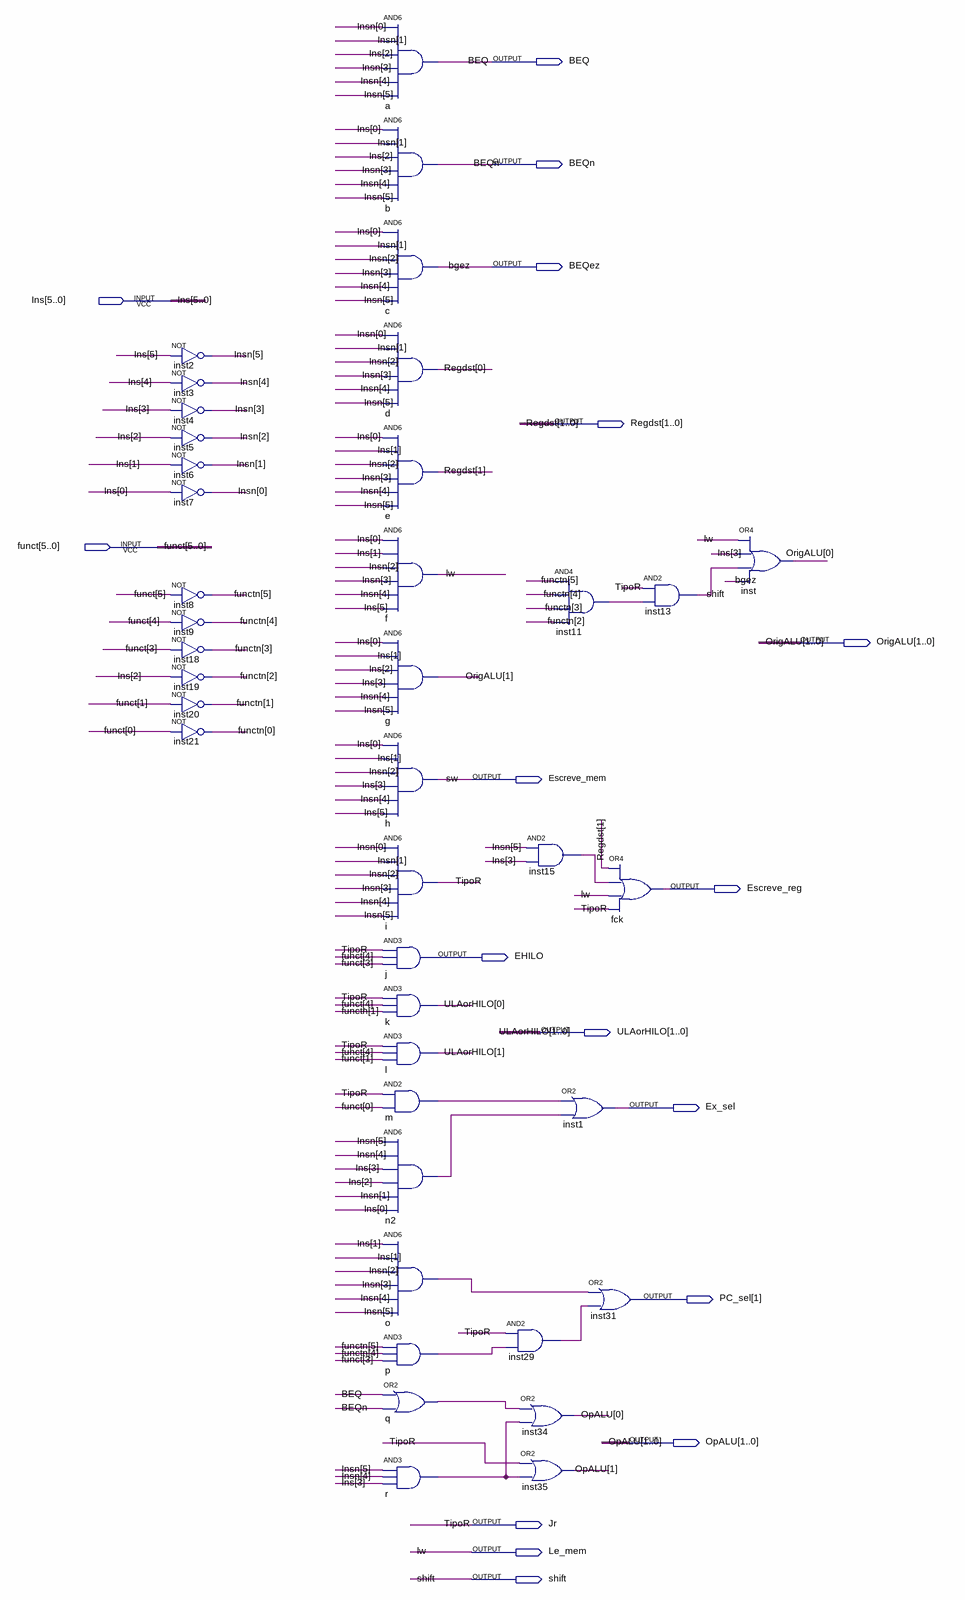
[diagram p0: schematic sheet]
// Quartus schematic Controle2.bdf as structural Verilog: 40 symbols, 17 pins
module Controle2 (
  input  [5:0] Ins,
  input  [5:0] funct,
  output BEQ,
  output BEQn,
  output BEQez,
  output [1:0] Regdst,
  output [1:0] OrigALU,
  output Escreve_mem,
  output Escreve_reg,
  output EHILO,
  output [1:0] ULAorHILO,
  output Ex_sel,
  output [1:1] PC_sel,
  output [1:0] OpALU,
  output Jr,
  output Le_mem,
  output shift
);

  wire inst11_out, inst15_out, inst29_out, m_out, n2_out, o_out, p_out, q_out, r_out;
  wire [5:0] functn, Insn;

  not inst2 (Insn[5], Ins[5]);
  not inst3 (Insn[4], Ins[4]);
  not inst4 (Insn[3], Ins[3]);
  not inst5 (Insn[2], Ins[2]);
  not inst6 (Insn[1], Ins[1]);
  not inst7 (Insn[0], Ins[0]);
  not inst8 (functn[5], funct[5]);
  not inst9 (functn[4], funct[4]);
  not inst18 (functn[3], funct[3]);
  not inst19 (functn[2], Ins[2]);
  not inst20 (functn[1], funct[1]);
  not inst21 (functn[0], funct[0]);
  and a (BEQ, Insn[0], Insn[1], Ins[2], Insn[3], Insn[4], Insn[5]);
  and b (BEQn, Ins[0], Insn[1], Ins[2], Insn[3], Insn[4], Insn[5]);
  and c (BEQez, Ins[0], Insn[1], Insn[2], Insn[3], Insn[4], Insn[5]);
  and d (Regdst[0], Insn[0], Insn[1], Insn[2], Insn[3], Insn[4], Insn[5]);
  and e (Regdst[1], Ins[0], Ins[1], Insn[2], Insn[3], Insn[4], Insn[5]);
  and f (Le_mem, Ins[0], Ins[1], Insn[2], Insn[3], Insn[4], Ins[5]);
  and g (OrigALU[1], Ins[0], Ins[1], Ins[2], Ins[3], Insn[4], Insn[5]);
  and h (Escreve_mem, Ins[0], Ins[1], Insn[2], Ins[3], Insn[4], Ins[5]);
  and i (Jr, Insn[0], Insn[1], Insn[2], Insn[3], Insn[4], Insn[5]);
  and j (EHILO, Jr, funct[4], funct[3]);
  and k (ULAorHILO[0], Jr, funct[4], functn[1]);
  and l (ULAorHILO[1], Jr, funct[4], funct[1]);
  and m (m_out, Jr, funct[0]);
  and n2 (n2_out, Insn[5], Insn[4], Ins[3], Ins[2], Insn[1], Ins[0]);
  and o (o_out, Ins[1], Ins[1], Insn[2], Insn[3], Insn[4], Insn[5]);
  and p (p_out, functn[5], functn[4], funct[3]);
  or q (q_out, BEQ, BEQn);
  and r (r_out, Insn[5], Insn[4], Ins[3]);
  and inst29 (inst29_out, Jr, p_out);
  and inst11 (inst11_out, functn[5], functn[4], functn[3], functn[2]);
  and inst15 (inst15_out, Insn[5], Ins[3]);
  or inst1 (Ex_sel, m_out, n2_out);
  or inst34 (OpALU[0], q_out, r_out);
  or inst35 (OpALU[1], Jr, r_out);
  or fck (Escreve_reg, Regdst[1], inst15_out, Le_mem, Jr);
  or inst31 (PC_sel[1], o_out, inst29_out);
  and inst13 (shift, Jr, inst11_out);
  or inst (OrigALU[0], Le_mem, Ins[3], shift, BEQez);

  // Other names for the same wires on the sheet: bgez = BEQez; lw = Le_mem; sw = Escreve_mem; TipoR = Jr
endmodule
